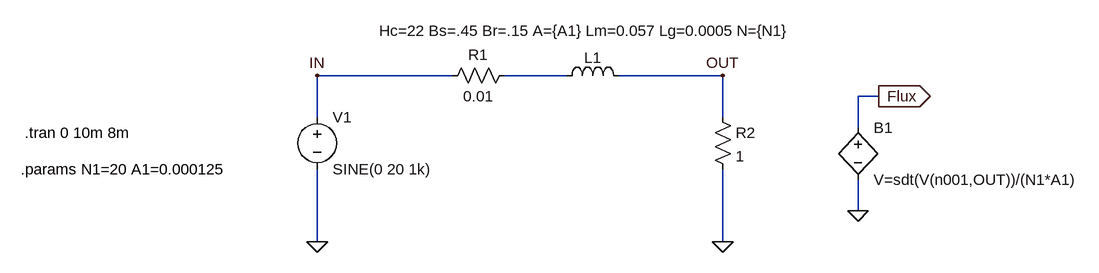
[diagram p0: schematic Flux.asc]
Flux.asc, the LTspice schematic file:
Version 4
SHEET 1 1356 680
WIRE 144 192 144 128
WIRE 144 384 144 272
WIRE 352 128 144 128
WIRE 528 128 432 128
WIRE 768 128 608 128
WIRE 768 192 768 128
WIRE 768 384 768 272
WIRE 976 208 976 160
WIRE 976 336 976 288
WIRE 1008 160 976 160
FLAG 144 384 0
FLAG 768 384 0
FLAG 144 128 IN
FLAG 768 128 OUT
FLAG 976 336 0
FLAG 1008 160 Flux
IOPIN 1008 160 Out
SYMBOL voltage 144 176 R0
WINDOW 123 0 0 Left 0
WINDOW 39 0 0 Left 0
SYMATTR InstName V1
SYMATTR Value SINE(0 20 1k)
SYMBOL ind 512 144 R270
WINDOW 0 59 56 VBottom 0
WINDOW 3 69 46 VTop 0
SYMATTR InstName L1
SYMATTR Value Hc=22 Bs=.45 Br=.15 A={A1} Lm=0.057 Lg=0.0005 N={N1}
SYMBOL res 752 176 R0
SYMATTR InstName R2
SYMATTR Value 1
SYMBOL res 448 112 R90
WINDOW 0 0 56 VBottom 0
WINDOW 3 32 56 VTop 0
SYMATTR InstName R1
SYMATTR Value 0.01
SYMBOL bv 976 192 R0
SYMATTR InstName B1
SYMATTR Value V=sdt(V(n001,OUT))/(N1*A1)
TEXT -306 216 Left 0 !.tran 0 10m 8m
TEXT -312 272 Left 0 !.params N1=20 A1=0.000125

The netlist it stands for:
* Flux.asc
V1 IN 0 SINE(0 20 1k)
L1 N001 OUT Hc=22 Bs=.45 Br=.15 A={A1} Lm=0.057 Lg=0.0005 N={N1}
R2 OUT 0 1
R1 N001 IN 0.01
B1 Flux 0 V=sdt(V(n001,OUT))/(N1*A1)
.tran 0 10m 8m
.params N1=20 A1=0.000125
.backanno
.end